# EAGLE schematic iface_schematic (EAGLE 7.7.0)
test
PROJECT_NAME: Anslut heat pump interface; PROJECT_RESPONSIBLE: skagmo.com
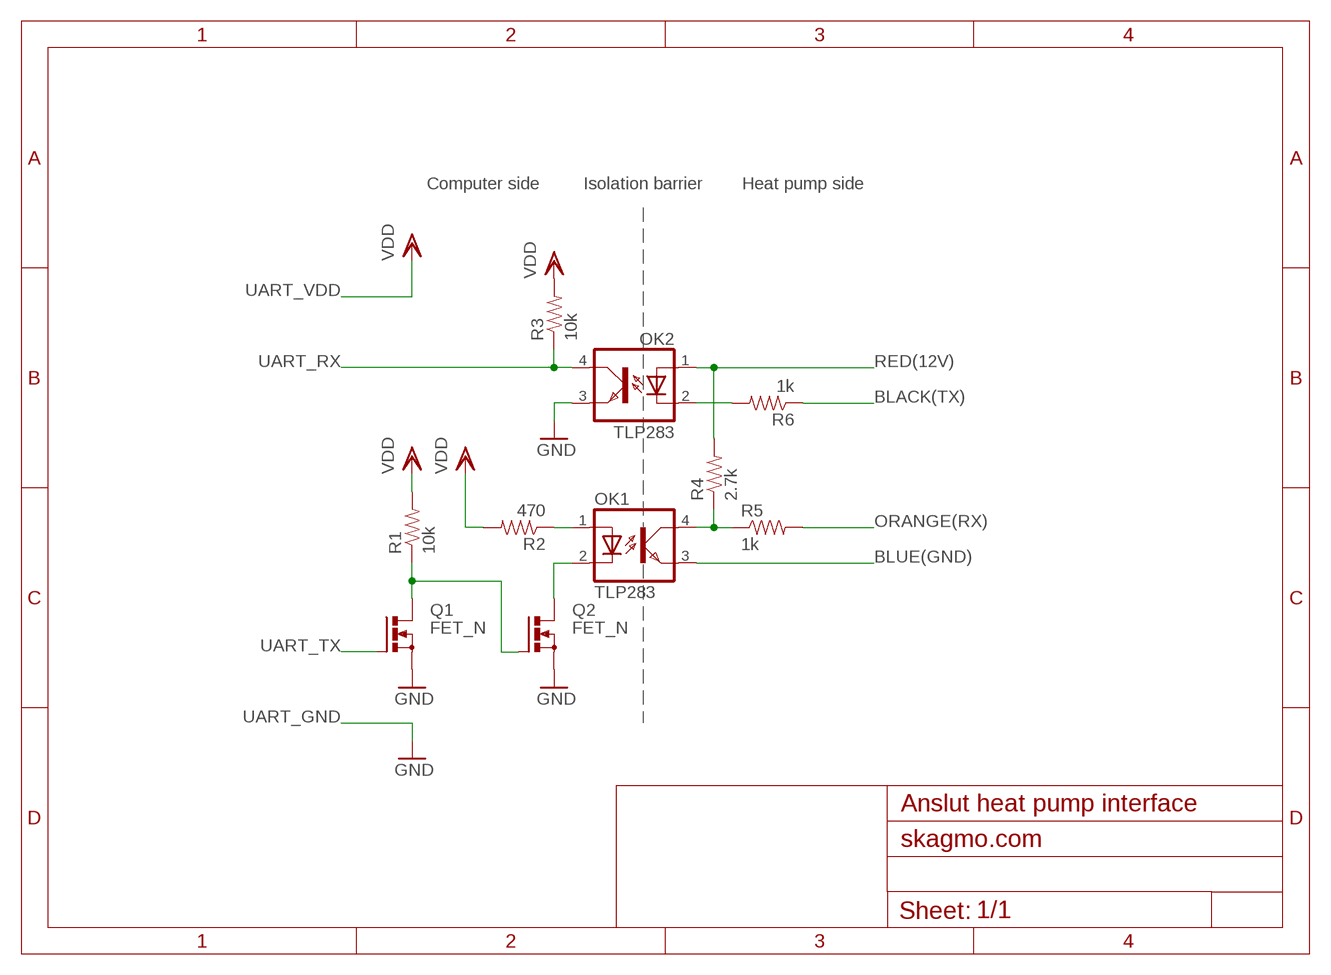
[diagram p0: schematic, sheet 1]

## Parts
OK1  TLP283  [MINI-FLAT-4]
OK2  TLP283  [MINI-FLAT-4]
Q1  FET_N  MOSFET_N_SOT23-3  [SOT23-3]
Q2  FET_N  MOSFET_N_SOT23-3  [SOT23-3]
R1  10k  RESISTOR0603  [0603]
R2  470  RESISTOR0603  [0603]
R3  10k  RESISTOR0603  [0603]
R4  2.7k  RESISTOR0603  [0603]
R5  1k  RESISTOR0603  [0603]
R6  1k  RESISTOR0603  [0603]

## Nets
BLACK(TX): R6.1
BLUE(GND): OK1.3(EMIT)
GND: OK2.3(EMIT) Q1.2(S) Q2.2(S)
N$1: OK1.2(C) Q2.3(D)
N$2: OK1.1(A) R2.1
N$3: Q1.3(D) Q2.1(G) R1.1
N$4: OK1.4(COL) R4.1 R5.1
N$5: OK2.2(C) R6.2
ORANGE(RX): R5.2
RED(12V): OK2.1(A) R4.2
UART_RX: OK2.4(COL) R3.1
UART_TX: Q1.1(G)
VDD: R1.2 R2.2 R3.2

## Notes on the sheet
- Computer side | Isolation barrier | Heat pump side

## Library data of the parts
OK1 OK2 = optocoupler:TLP283: TOSHIBA PHOTOCOUPLER GaAs IRED & PHOTO-TRANSISTOR Source: http://www.semicon.toshiba.co.jp/td/en/Opto/Photocoupler/en_20050928_TLP283_datasheet.pdf; OC_FARNELL: unknown; OC_NEWARK: unknown
Q1 Q2 = 01-eos-components:MOSFET_N
R1-R6 = 01-eos-components:RESISTOR: Resistor Basic schematic elements and footprints for 0603, 1206, and PTH 1/10th watt (small) resistors.